# EAGLE design logoi_smd_gndpln v0.2 (EAGLE 9.0.0)
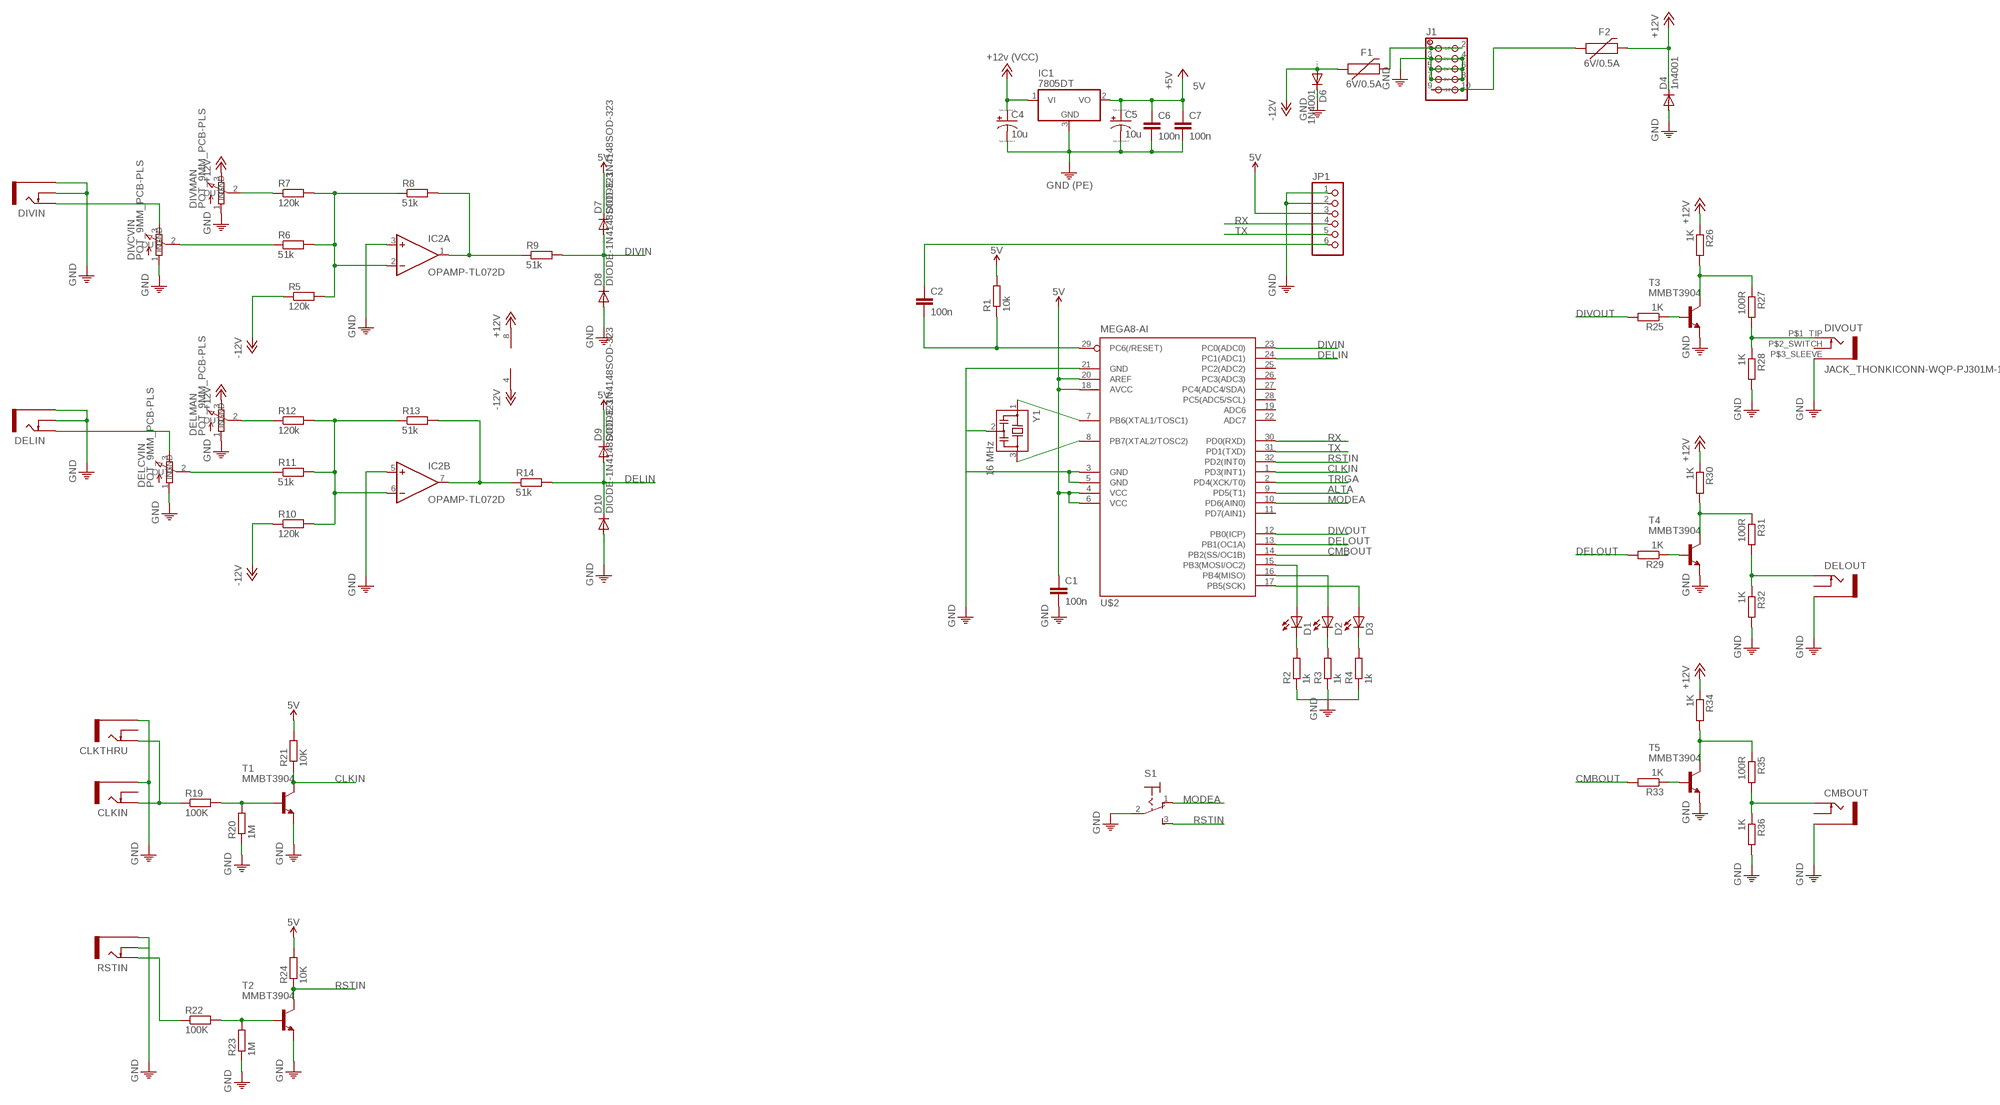
[diagram p0: schematic, sheet 1]

## Parts
C1  100n  CAPACITOR-EUC0603K  [C0603K]
C2  100n  CAPACITOR-EUC0603K  [C0603K]
C4  10u  CAPACITOR_POLARIZED-USB  [PANASONIC_B]
C5  10u  CAPACITOR_POLARIZED-USB  [PANASONIC_B]
C6  100n  CAPACITOR-EUC0603K  [C0603K]
C7  100n  CAPACITOR-EUC0603K  [C0603K]
CLKIN  JACK_THONKICONNNEW  [WQP-PJ301M-12_JACK]
CLKTHRU  JACK_THONKICONNNEW  [WQP-PJ301M-12_JACK]
CMBOUT  JACK_THONKICONNNEW  [WQP-PJ301M-12_JACK]
D1  LED3MM  [LED3MM]
D2  LED3MM  [LED3MM]
D3  LED3MM  [LED3MM]
D4  1n4001  DIODE-DO-214AC  [DO-214AC]
D6  1N4001  DIODE-DO-214AC  [DO-214AC]
D7  DIODE-1N4148SOD-323  [SOD323W_INFINEON]
D8  DIODE-1N4148SOD-323  [SOD323W_INFINEON]
D9  DIODE-1N4148SOD-323  [SOD323W_INFINEON]
D10  DIODE-1N4148SOD-323  [SOD323W_INFINEON]
DELCVIN  POT_9MM_PCB-PLS  [9MM_PLS]
DELIN  JACK_THONKICONNNEW  [WQP-PJ301M-12_JACK]
DELMAN  POT_9MM_PCB-PLS  [9MM_PLS]
DELOUT  JACK_THONKICONNNEW  [WQP-PJ301M-12_JACK]
DIVCVIN  POT_9MM_PCB-PLS  [9MM_PLS]
DIVIN  JACK_THONKICONNNEW  [WQP-PJ301M-12_JACK]
DIVMAN  POT_9MM_PCB-PLS  [9MM_PLS]
DIVOUT  JACK_THONKICONN-WQP-PJ301M-12  [WQP-PJ301M-12_JACK]
F1  6V/0.5A  FUSE-PPTC_HALF-AMP  [1206]
F2  6V/0.5A  FUSE-PPTC_HALF-AMP  [1206]
IC1  7805DT  [TO252]
IC2  OPAMP-TL072D  [SO08]
J1  HEADER-EUROPWR_2X05-OPEN  [2X05_EUROPWR_OPEN]
JP1  PINHD-1X6  [1X06]
R1  10k  RESISTOR-EU_R0603  [R0603]
R2  1k  RESISTOR-EU_R0603  [R0603]
R3  1k  RESISTOR-EU_R0603  [R0603]
R4  1k  RESISTOR-EU_R0603  [R0603]
R5  120k  RESISTOR-EU_R0603  [R0603]
R6  51k  RESISTOR-EU_R0603  [R0603]
R7  120k  RESISTOR-EU_R0603  [R0603]
R8  51k  RESISTOR-EU_R0603  [R0603]
R9  51k  RESISTOR-EU_R0603  [R0603]
R10  120k  RESISTOR-EU_R0603  [R0603]
R11  51k  RESISTOR-EU_R0603  [R0603]
R12  120k  RESISTOR-EU_R0603  [R0603]
R13  51k  RESISTOR-EU_R0603  [R0603]
R14  51k  RESISTOR-EU_R0603  [R0603]
R19  100K  RESISTOR-EU_R0603  [R0603]
R20  1M  RESISTOR-EU_R0603  [R0603]
R21  10K  RESISTOR-EU_R0603  [R0603]
R22  100K  RESISTOR-EU_R0603  [R0603]
R23  1M  RESISTOR-EU_R0603  [R0603]
R24  10K  RESISTOR-EU_R0603  [R0603]
R25  1K  RESISTOR-EU_R0603  [R0603]
R26  1K  RESISTOR-EU_R0603  [R0603]
R27  100R  RESISTOR-EU_R0603  [R0603]
R28  1K  RESISTOR-EU_R0603  [R0603]
R29  1K  RESISTOR-EU_R0603  [R0603]
R30  1K  RESISTOR-EU_R0603  [R0603]
R31  100R  RESISTOR-EU_R0603  [R0603]
R32  1K  RESISTOR-EU_R0603  [R0603]
R33  1K  RESISTOR-EU_R0603  [R0603]
R34  1K  RESISTOR-EU_R0603  [R0603]
R35  100R  RESISTOR-EU_R0603  [R0603]
R36  1K  RESISTOR-EU_R0603  [R0603]
RSTIN  JACK_THONKICONNNEW  [WQP-PJ301M-12_JACK]
S1  SWITCH-SPDT-320-916  [320-916]
T1  MMBT3904  TRANSISTOR-NPN-MMBT3904LT1SOT23-BEC  [SOT23-BEC]
T2  MMBT3904  TRANSISTOR-NPN-MMBT3904LT1SOT23-BEC  [SOT23-BEC]
T3  MMBT3904  TRANSISTOR-NPN-MMBT3904LT1SOT23-BEC  [SOT23-BEC]
T4  MMBT3904  TRANSISTOR-NPN-MMBT3904LT1SOT23-BEC  [SOT23-BEC]
T5  MMBT3904  TRANSISTOR-NPN-MMBT3904LT1SOT23-BEC  [SOT23-BEC]
U$2  MEGA8-AI  [TQFP32-08]
Y1  16 MHz  CSTCR6M00G53Z  [CSTCR6M]

## Nets
5V [GND]: C1.1 C5.+ C6.1 C7.1 D7.C D9.C IC1.2(VO) JP1.3 R1.2 R21.2 R24.2 U$2.4(VCC) U$2.6(VCC) U$2.18(AVCC) U$2.20(AREF) ; supply symbol labelled +5V
+12V [GND]: C4.+ D4.C DELMAN.3(IN) DIVMAN.3(IN) F2.2 IC1.1(VI) IC2.8(P:V+) R26.1 R30.1 R34.1 ; supply symbol labelled POWER+12V
-12V [GND]: D6.A F1.1 IC2.4(P:V-) R5.1 R10.1
ALTA: U$2.9(PD5(T1))
CLKIN: R21.1 T1.C U$2.1(PD3(INT1))
CMBOUT: R33.2 U$2.14(PB2(SS/OC1B))
DELIN: D9.A D10.C R14.2 U$2.24(PC1(ADC1))
DELOUT: R29.2 U$2.13(PB1(OC1A))
DIVIN: D7.A D8.C R9.2 U$2.23(PC0(ADC0))
DIVOUT: R25.2 U$2.12(PB0(ICP))
MODEA: S1.1(O) U$2.10(PD6(AIN0))
N$1: U$2.7(PB6(XTAL1/TOSC1)) Y1.1
N$2: U$2.8(PB7(XTAL2/TOSC2)) Y1.3
N$3 [GND]: F1.2 J1.1 J1.2
N$4: C2.2 R1.1 U$2.29(PC6(/RESET))
N$5: C2.1 JP1.6
N$7 [GND]: F2.1 J1.9 J1.10
N$9: IC2.2(A:-IN) R5.2 R6.2 R7.2 R8.1
N$10: IC2.1(A:OUT) R8.2 R9.1
N$12: R25.1 T3.B
N$13: IC2.6(B:-IN) R10.2 R11.2 R12.2 R13.1
N$14: R26.2 R27.1 T3.C
N$15: IC2.7(B:OUT) R13.2 R14.1
N$17: DIVOUT.P$1_TIP R27.2 R28.1
N$18: DIVCVIN.3(IN) DIVIN.P$1_TIP(TIP)
N$19: DIVCVIN.2(OUT) R6.1
N$20: DIVMAN.2(OUT) R7.1
N$21: D1.K(C) R2.2
N$22: D2.K(C) R3.2
N$23: D3.K(C) R4.2
N$24: D1.A U$2.15(PB3(MOSI/OC2))
N$25: D2.A U$2.16(PB4(MISO))
N$26: D3.A U$2.17(PB5(SCK))
N$27: DELCVIN.2(OUT) R11.1
N$28: DELCVIN.3(IN) DELIN.P$1_TIP(TIP)
N$29: DELMAN.2(OUT) R12.1
N$30: CLKIN.P$1_TIP(TIP) CLKTHRU.P$1_TIP(TIP) R19.1
N$31: R19.2 R20.2 T1.B
N$33: R22.1 RSTIN.P$1_TIP(TIP)
N$34: R22.2 R23.2 T2.B
N$35: R29.1 T4.B
N$36: R30.2 R31.1 T4.C
N$37: DELOUT.P$1_TIP(TIP) R31.2 R32.1
N$39: R33.1 T5.B
N$40: R34.2 R35.1 T5.C
N$41: CMBOUT.P$1_TIP(TIP) R35.2 R36.1
PE [GND]: C1.2 C4.- C5.- C6.2 C7.2 CLKIN.P$3_SLEEVE(SLEEVE) CLKTHRU.P$3_SLEEVE(SLEEVE) CMBOUT.P$3_SLEEVE(SLEEVE) D4.A D6.C D8.A D10.A DELCVIN.1(GND) DELIN.P$2_SWITCH(SWITCH) DELIN.P$3_SLEEVE(SLEEVE) DELMAN.1(GND) DELOUT.P$3_SLEEVE(SLEEVE) DIVCVIN.1(GND) DIVIN.P$2_SWITCH(SWITCH) DIVIN.P$3_SLEEVE(SLEEVE) DIVMAN.1(GND) DIVOUT.P$3_SLEEVE IC1.3(GND) IC2.3(A:+IN) IC2.5(B:+IN) J1.3 J1.4 J1.5 J1.6 J1.7 J1.8 JP1.1 JP1.2 R2.1 R3.1 R4.1 R20.1 R23.1 R28.2 R32.2 R36.2 RSTIN.P$2_SWITCH(SWITCH) RSTIN.P$3_SLEEVE(SLEEVE) S1.2(P) T1.E T2.E T3.E T4.E T5.E U$2.3(GND) U$2.5(GND) U$2.21(GND) Y1.2 ; supply symbol labelled GND, POWER-GND
RSTIN: R24.1 S1.3(S) T2.C U$2.32(PD2(INT0))
RX: JP1.4 U$2.30(PD0(RXD))
TRIGA: U$2.2(PD4(XCK/T0))
TX: JP1.5 U$2.31(PD1(TXD))
Unconnected: CLKIN.P$2_SWITCH(SWITCH) CLKTHRU.P$2_SWITCH(SWITCH) CMBOUT.P$2_SWITCH(SWITCH) DELOUT.P$2_SWITCH(SWITCH) DIVOUT.P$2_SWITCH U$2.11(PD7(AIN1)) U$2.19(ADC6) U$2.22(ADC7) U$2.25(PC2(ADC2)) U$2.26(PC3(ADC3)) U$2.27(PC4(ADC4/SDA)) U$2.28(PC5(ADC5/SCL))

## Library data of the parts
C1 C2 C6 C7 = 0000-master:CAPACITOR-EU: CAPACITOR, European symbol
C4 C5 = 0000-master:CAPACITOR_POLARIZED-US: POLARIZED CAPACITOR, American symbol
CLKIN CLKTHRU CMBOUT DELIN DELOUT DIVIN RSTIN = 0000-master:JACK_THONKICONN: 3.5mm socket for Eurorack modular synths
D1-D3 = 0000-master:LED: LED OSRAM: - CHIPLED LG R971, LG N971, LY N971, LG Q971, LY Q971, LO R971, LY R971 LH N974, LH R974 LS Q976, LO Q976, LY Q976 LO Q996 - Hyper CHIPLED LW Q18S LB Q993, LB Q99A, LB R99A - SideLED LS A670, LO A670, LY A670, LG A670, LP A670 LB A673, LV A673, LT A673, LW A673 LH A674 LY A675 LS A676, LA A676, LO A676, LY A676, LW A676 LS A679, LY A679, LG A679 - Hyper Micro SIDELED® LS Y876, LA Y876, LO Y876, LY Y876 LT Y87S - SmartLED LW L88C, LW L88S LB L89C, LB L89S, LG L890 LS L89K, LO L89K, LY L89K LS L896, LA L896, LO L896, LY L896 - TOPLED LS T670, LO T670, LY T670, LG T670, LP T670 LSG T670, LSP T670, LSY T670, LOP T670, LYG T670 LG T671, LOG T671, LSG T671 LB T673, LV T673, LT T673, LW T673 LH T674 LS T676, LA T676, LO T676, LY T676, LB T676, LH T676, LSB T676, LW T676 LB T67C, LV T67C, LT T67C, LS T67K, LO T67K, LY T67K, LW E67C LS E67B, LA E67B, LO E67B, LY E67B, LB E67C, LV E67C, LT E67C LW T67C LS T679, LY T679, LG T679 LS T770, LO T770, LY T770, LG T770, LP T770 LB T773, LV T773, LT T773, LW T773 LH T774 LS E675, LA E675, LY E675, LS T675 LS T776, LA T776, LO T776, LY T776, LB T776 LHGB T686 LT T68C, LB T68C - Hyper Mini TOPLED® LB M676 - Mini TOPLED Santana® LG M470 LS M47K, LO M47K, LY M47K Source: http://www.osram.convergy.de LUXEON: - LUMILED® LXK2-PW12-R00, LXK2-PW12-S00, LXK2-PW14-U00, LXK2-PW14-V00 LXK2-PM12-R00, LXK2-PM12-S00, LXK2-PM14-U00 LXK2-PE12-Q00, LXK2-PE12-R00, LXK2-PE12-S00, LXK2-PE14-T00, LXK2-PE14-U00 LXK2-PB12-K00, LXK2-PB12-L00, LXK2-PB12-M00, LXK2-PB14-N00, LXK2-PB14-P00, LXK2-PB14-Q00 LXK2-PR12-L00, LXK2-PR12-M00, LXK2-PR14-Q00, LXK2-PR14-R00 LXK2-PD12-Q00, LXK2-PD12-R00, LXK2-PD12-S00 LXK2-PH12-R00, LXK2-PH12-S00 LXK2-PL12-P00, LXK2-PL12-Q00, LXK2-PL12-R00 Source: www.luxeon.com KINGBRIGHT: KA-3528ASYC Source: www.kingbright.com
D4 D6 = diode:DIODE-: DIODE
D7-D10 = 0000-master:DIODE-1N4148: DIODE high speed (Philips)
DELCVIN DELMAN DIVCVIN DIVMAN = 0000-master:POT_9MM_PCB: 9 mm Square Rotary Potentiometers Source: Panasonic
DIVOUT = 0000-master:JACK_THONKICONN-WQP-PJ301M-12
F1 F2 = 0000-master:FUSE-PPTC: Resettable Fuse PPTC Resettable Fuse. Really a sort of resistor with a polymeric positive temperature coefficient whose resistance increases dramatically with an increase in temperature. When heated by the power passing through the resistance rises causing the current to be limited, protecting the circuit. This is achieved by the transition of the polymer from a crystalline to an amorphous state where the conductive carbon separates breaking the conductive pathways found in the cool crystalline structure. When a PPTC cools back down it resumes conducting letting the circuit turn back on. SparkFun Products: SparkFun RedBoard - Programmed with Arduino <https://www.sparkfun.com/products/12757> Pro Micro - 5V/16MHz <https://www.sparkfun.com/products/12640> Arduino Pro 328 - 5V/16MHz <https://www.sparkfun.com/products/10915> MP3 Trigger <https://www.sparkfun.com/products/13720>; PROD_ID: RES-08585
IC1 = linear:78*: Positive VOLTAGE REGULATOR Source: http://cache.national.com/ds/LM/LM78L05.pdf http://www.fairchildsemi.com/ds/LM/LM7805.pdf
IC2 = 0000-master:OPAMP-TL072: OP AMP
J1 = 0000-master:HEADER-EUROPWR_2X05: 2x05 pin header
JP1 = pinhead:PINHD-1X6: PIN HEADER
R1-R14 R19-R36 = 0000-master:RESISTOR-EU_: RESISTOR, European symbol
S1 = 0000-master:SWITCH-SPDT-320-916: TOGGLE SWITCH distributor RS Components
T1-T5 = 0000-master:TRANSISTOR-NPN-: NPN Transistror BF959 corrected 2008.03.06
U$2 = atmel:MEGA8: MICROCONTROLLER 8 Kbytes FLASH, 1 kbytes SRAM, 512 bytes EEPROM, USART, 6-channel 10 bit ADC, 2-channel 8 bit ADC Pin compatible with Atmega48, ATMega88, ATMega168 Source: avr.lbr; MPN: ATMEGA8-16AU; OC_FARNELL: 9171371; OC_NEWARK: 73M8863
Y1 = murata-filter:CSTCR: Resonator Source: murata.co.jp; MPN: CSTCR6M00G53-R0; OC_FARNELL: 1170434; OC_NEWARK: 25M8759

## Net classes
0 default: width 0.203 mm
1 GND: width 0.305 mm

## Board
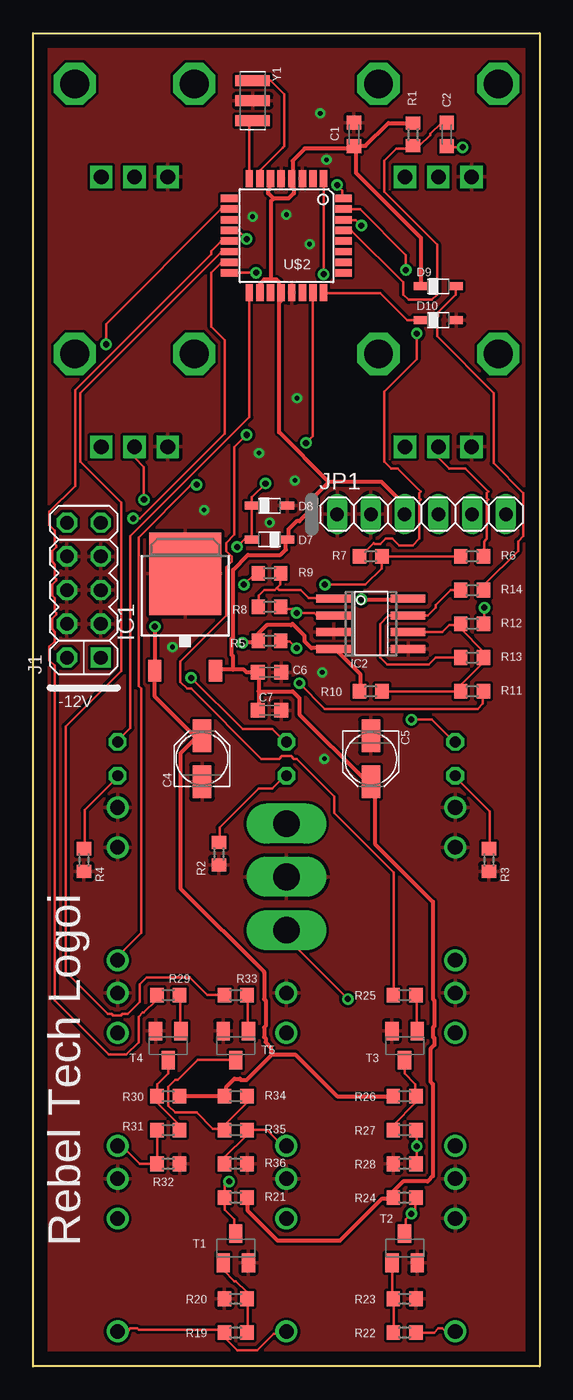
[diagram p1: board, top side]
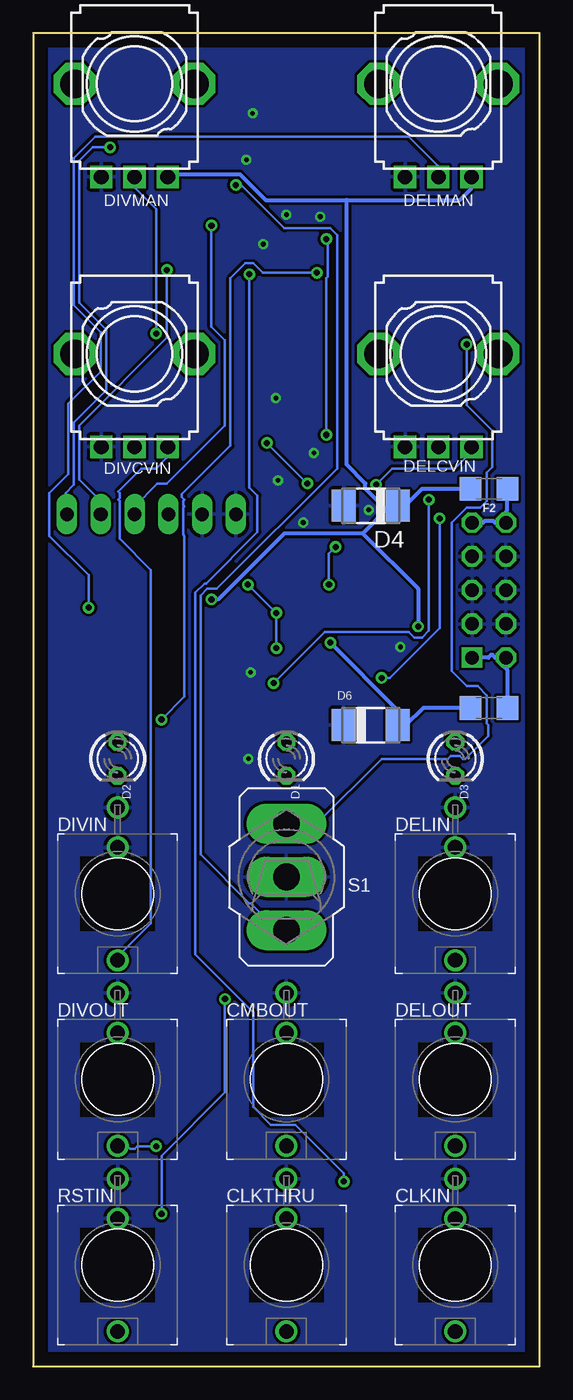
[diagram p2: board, bottom side, seen from below]

Size 38.1 x 100.33 mm. Coordinates in mm from the lower left corner, seen from the top.
Outline: 0,0 0,100.33 38.1,100.33 38.1,0 0,0
Copper layers (1*16): Top 0.035mm / dielectric 1.5mm / Bottom 0.035mm
Design rules "default *": minimum track width 8mil, minimum drill 18mil, track to track 8mil, track to pad 8mil, pad to pad 8mil, via to via 8mil, smd to smd 8mil, copper to edge 40mil, drill to drill 8mil, minimum pad ring 10mil, minimum via ring 8mil, stop-mask expansion 4mil, vias tented up to drill 18mil, thermal gap 10mil

### Footprints (pad centres in the part's own frame; a part is rotated, then mirrored left to right if it is on the bottom)
C0603K = smd 1.05 x 1.08: 1 -0.875,0; 2 0.875,0
PANASONIC_B = smd 2.454 x 1.4: + 1.727,0; - -1.727,0
WQP-PJ301M-12_JACK = drill 1.1: P$1_TIP 0,5; P$2_SWITCH 0,-3.5; P$3_SLEEVE 0,-6.5
LED3MM = drill 0.813 octagon: A -1.27,0; K 1.27,0
DO-214AC = smd 1.8 x 2.4: A 2.025,0; C -2.025,0
SOD323W_INFINEON = smd 1 x 0.6: A 1.35,0; C -1.35,0
9MM_PLS = drill 1.1 pad 1.676 square: 1 -2.5,-7; 2 0,-7; 3 2.5,-7 | drill 2.159 pad 3.175 octagon: M1 4.5,0; M2 -4.5,0
1206 = smd 1.6 x 1.8: 1 -1.4,0; 2 1.4,0
TO252 = smd 1 x 1.6: 1 -2.28,-4.8; 2 2.28,-4.8 | smd 5.4 x 6.2: 3 0,2.5
SO08 = smd 0.6 x 2.6: 1 -1.905,-2.8; 2 -0.635,-2.8; 3 0.635,-2.8; 4 1.905,-2.8; 5 1.905,2.8; 6 0.635,2.8; 7 -0.635,2.8; 8 -1.905,2.8
2X05_EUROPWR_OPEN = drill 1.016 square: 1 -5.08,-1.27 | drill 1.016 octagon: 2 -5.08,1.27; 3 -2.54,-1.27; 4 -2.54,1.27; 5 0,-1.27; 6 0,1.27; 7 2.54,-1.27; 8 2.54,1.27; 9 5.08,-1.27; 10 5.08,1.27
1X06 = drill 1.016 long: 1 -6.35,0; 2 -3.81,0; 3 -1.27,0; 4 1.27,0; 5 3.81,0; 6 6.35,0
R0603 = smd 1 x 1.1: 1 -0.85,0; 2 0.85,0
320-916 = drill 2.007 long: 1 0,4.013; 2 0,0; 3 0,-4.013
SOT23-BEC = smd 1 x 1.4: B -0.95,-1.1; C 0,1.1; E 0.95,-1.1
TQFP32-08 = smd 1.27 x 0.559: 1 -4.293,2.8; 2 -4.293,2; 3 -4.293,1.2; 4 -4.293,0.4; 5 -4.293,-0.4; 6 -4.293,-1.2; 7 -4.293,-2; 8 -4.293,-2.8; 17 4.293,-2.8; 18 4.293,-2; 19 4.293,-1.2; 20 4.293,-0.4; 21 4.293,0.4; 22 4.293,1.2; 23 4.293,2; 24 4.293,2.8 | smd 0.559 x 1.27: 9 -2.8,-4.293; 10 -2,-4.293; 11 -1.2,-4.293; 12 -0.4,-4.293; 13 0.4,-4.293; 14 1.2,-4.293; 15 2,-4.293; 16 2.8,-4.293; 25 2.8,4.293; 26 2,4.293; 27 1.2,4.293; 28 0.4,4.293; 29 -0.4,4.293; 30 -1.2,4.293; 31 -2,4.293; 32 -2.8,4.293
CSTCR6M = smd 0.8 x 2.6: 1 -1.5,0; 2 0,0; 3 1.5,0

### Placement (x,y rotation side)
C1  24.13,92.71 90 top
C2  31.11,92.71 90 top
C4  12.7,45.72 90 top
C5  25.4,45.72 270 top
C6  17.78,52.23 0 top
C7  17.78,49.37 0 top
CLKIN  6.35,7.62 180 bottom
CLKTHRU  19.05,7.62 180 bottom
CMBOUT  19.05,21.59 180 bottom
D1  19.05,45.72 270 bottom
D2  31.75,45.72 270 bottom
D3  6.35,45.72 270 bottom
D4  12.7,64.77 180 bottom
D6  12.7,48.26 0 bottom
D7  17.78,62.23 180 top
D8  17.78,64.77 0 top
D9  30.48,81.28 0 top
D10  30.48,78.74 0 top
DELCVIN  7.62,76.2 0 bottom
DELIN  6.35,35.56 180 bottom
DELMAN  7.62,96.52 0 bottom
DELOUT  6.35,21.59 180 bottom
DIVCVIN  30.48,76.2 0 bottom
DIVIN  31.75,35.56 180 bottom
DIVMAN  30.48,96.52 0 bottom
DIVOUT  31.75,21.59 180 bottom
F1  3.81,49.53 0 bottom
F2  3.81,66.04 180 bottom
IC1  11.43,57.15 0 top
IC2  25.4,55.88 270 top
J1  3.81,58.42 90 top
JP1  29.21,64.14 0 top
R1  28.57,92.71 90 top
R2  13.97,38.58 90 top
R3  34.29,38.1 90 top
R4  3.81,38.1 90 top
R5  17.78,54.61 0 top
R6  33.02,60.96 180 top
R7  25.4,60.96 0 top
R8  17.78,57.15 180 top
R9  17.78,59.69 180 top
R10  25.4,50.8 0 top
R11  33.02,50.8 180 top
R12  33.02,55.88 180 top
R13  33.02,53.34 180 top
R14  33.02,58.42 0 top
R19  15.24,2.54 0 top
R20  15.24,5.08 0 top
R21  15.24,12.7 0 top
R22  27.94,2.54 180 top
R23  27.94,5.08 180 top
R24  27.94,12.7 180 top
R25  27.94,27.94 180 top
R26  27.94,20.32 0 top
R27  27.94,17.78 0 top
R28  27.94,15.24 180 top
R29  10.16,27.94 180 top
R30  10.16,20.32 180 top
R31  10.16,17.78 180 top
R32  10.16,15.24 0 top
R33  15.24,27.94 180 top
R34  15.24,20.32 0 top
R35  15.24,17.78 0 top
R36  15.24,15.24 0 top
RSTIN  31.75,7.62 180 bottom
S1  19.05,36.83 0 bottom
T1  15.24,8.89 0 top
T2  27.94,8.89 0 top
T3  27.94,24.13 180 top
T4  10.16,24.13 180 top
T5  15.24,24.13 180 top
U$2  19.05,85.09 270 top
Y1  16.51,95.25 270 top

### Tracks (layer width: path | path; a pad name or v marks a point on that pad's centre or on a via)
5V
  Top 0.305: 17.88,81.79 18.29,81.79 18.49,81.58 18.49,80.97 18.59,80.87 U$2.20 18.59,80.67 18.59,80.16 18.49,80.06 18.49,70.31 22.25,66.55 | 17.88,81.79 17.37,81.79 17.07,81.48 17.07,80.87 U$2.18 | 18.09,87.88 17.68,88.29 17.68,88.49 17.78,88.59 17.78,89.31 U$2.6 | 18.09,87.88 19.2,87.88 19.61,88.29 19.61,88.59 19.41,88.8 19.41,89.31 U$2.4 19.51,89.51 19.51,90.73 20.42,91.64 24.08,91.64 C1.1 | 17.88,81.79 17.88,87.68 18.09,87.88 | D9.C 29.16,81.28 29.16,84.94 24.28,89.81 24.28,91.64 24.18,91.75 C1.1 | R1.2 28.55,93.57 26.72,93.57 24.99,91.85 24.28,91.85 C1.1 | 22.25,66.55 21.23,65.53 21.23,64.82 20.02,63.6 19.81,63.6 19.2,62.99 19.2,62.28 D7.C 19,62.18 19,61.47 18.59,61.06 16.15,61.06 15.04,59.94 15.04,54.86 14.94,54.76 14.94,53.54 15.04,53.44 15.04,52.43 | 22.25,66.55 26.21,66.55 27.94,64.82 JP1.3 | R21.2 16.15,12.7 16.15,11.68 18.39,9.45 23.06,9.45 26.21,12.6 26.92,12.6 27.03,12.7 R24.2 27.13,12.8 27.13,13.21 27.84,13.92 29.67,13.92 30.07,14.33 30.07,21.23 29.87,21.44 29.87,23.88 30.18,24.18 30.18,24.69 30.07,24.79 30.07,25.5 30.18,25.6 30.18,27.53 30.07,27.64 30.07,34.95 25.7,39.32 25.7,43.69 C5.+ | 16.97,50.8 16.97,52.22 C6.1 16.87,52.22 16.05,52.22 15.85,52.43 15.04,52.43 | 16.97,50.8 16.97,49.38 C7.1 | 15.04,52.43 13.72,52.43 IC1.2 | 16.97,50.8 19.51,50.8 20.02,50.29 20.02,49.07 24.89,44.2 25.4,44.2 C5.+ | C5.+
+12V  (via drill 0.46)
  Top 0.305: R30.1 R34.1 14.53,20.32 14.53,21.03 15.14,21.64 15.54,21.64 15.65,21.54 16.05,21.54 17.98,23.47 | R26.1 22.86,20.32 19.71,23.47 17.98,23.47 | v24.69,57.71 28.14,57.71 IC2.8 | v9.14,55.68 9.14,52.43 IC1.1 9.14,52.32 9.14,50.39 12.19,47.35 12.7,47.35 C4.+ 12.29,47.24 12.19,47.14 12.09,47.14 11.07,46.13 11.07,35.97 17.37,29.67 17.37,27.64 17.48,27.53 17.48,25.6 17.37,25.5 17.37,24.79 17.48,24.69 17.48,24.38 17.88,23.98 17.88,23.57 17.98,23.47
  Bottom 0.305: 14.53,87.78 20.62,87.78 22.55,89.71 27.84,89.71 27.94,89.61 DIVMAN.3 | 14.53,87.78 5.99,87.78 5.18,88.59 5.18,89.51 DELMAN.3 | F2.2 8.84,66.04 10.06,64.82 10.67,64.82 D4.C 10.77,64.72 11.28,64.72 11.53,64.47 | v24.69,57.71 24.18,57.71 19.2,62.69 13.31,62.69 | 11.53,64.47 13.31,62.69 | v9.14,55.68 9.14,58.52 13.31,62.69 | 14.53,87.78 14.53,67.87 13.11,66.45 13.11,66.04 11.53,64.47
-12V  (via drill 0.46)
  Top 0.305: R10.1 24.59,50.8 24.59,52.12 22.66,54.05 IC2.4 22.55,54.05 20.93,54.05 20.42,54.56 20.42,54.97 19.51,55.88 19.41,55.78 17.58,55.78 16.97,55.17 16.97,54.66 R5.1 16.87,54.56 16.76,54.46 v15.75,54.46
  Bottom 0.305: F1.1 5.28,49.58 8.74,49.58 10.06,48.26 D6.A 10.77,48.36 10.77,49.48 v15.75,54.46
CLKIN  (via drill 0.46)
  Top 0.203: 14.43,12.7 14.43,11.79 15.14,11.07 15.14,10.16 15.24,10.06 T1.C | v21.84,82.19 21.84,89.31 U$2.1 | v14.73,13.92 14.43,13.61 14.43,12.7 | 14.43,12.7 R21.1
  Bottom 0.203: v21.84,82.19 21.84,66.14 21.23,65.53 21.23,62.79 25.09,58.93 25.2,58.93 25.91,58.22 25.91,30.99 21.54,26.62 21.54,19.51 20.22,18.19 18.39,18.19 14.73,14.53 v14.73,13.92
CMBOUT
  Top 0.203: R33.2 13.11,27.94 11.79,29.26 8.53,29.26 8.03,28.75 8.03,27.43 7.11,26.52 6.71,26.52 6.6,26.42 5.99,26.42 5.89,26.52 5.59,26.52 2.44,29.67 2.44,48.16 6.6,52.32 6.6,65.02 3.56,68.07 3.56,73.25 14.12,83.82 14.73,83.82 U$2.14
DELIN
  Top 0.203: 30.23,78.79 30.48,79.05 30.48,79.35 31.8,80.67 31.8,81.28 D9.A | 30.23,78.79 30.18,78.74 D10.C 28.14,78.74 26.11,80.77 21.95,80.77 U$2.24 | 30.23,78.79 30.38,78.64 30.38,77.52 34.65,73.25 34.65,67.97 36.88,65.73 36.88,62.48 36.47,62.08 36.47,61.37 33.93,58.83 33.93,58.42 R14.2
DELOUT
  Top 0.203: R29.2 9.25,27.94 9.25,27.53 8.33,26.62 8.23,26.62 7.92,26.31 7.92,24.38 7.01,23.47 5.69,23.47 1.63,27.53 1.63,52.73 1.22,53.14 1.22,54.15 1.63,54.56 1.63,55.27 1.42,55.47 1.42,56.29 1.73,56.59 1.73,56.69 1.63,56.79 1.63,57.81 1.42,58.01 1.42,58.83 1.73,59.13 1.73,59.23 1.63,59.33 1.63,60.35 1.42,60.55 1.42,61.37 1.73,61.67 1.73,61.77 1.63,61.87 1.63,62.89 1.22,63.3 1.22,64.31 3.15,66.24 3.15,73.46 13.41,83.72 13.41,83.92 14.12,84.63 14.73,84.63 U$2.13
DIVIN  (via drill 0.46)
  Top 0.203: v15.85,58.83 16.66,59.64 16.87,59.64 R9.2 | v15.34,61.67 15.95,62.28 16.36,62.28 D7.A 16.46,62.28 16.46,64.72 D8.C 16.46,64.82 16.46,65.43 v17.48,66.45 | v20.52,69.49 21.03,70 21.03,80.77 U$2.23
  Bottom 0.203: v15.85,58.83 15.85,61.16 v15.34,61.67 | v17.48,66.45 v20.52,69.49
DIVOUT  (via drill 0.46)
  Top 0.203: v16.05,70.1 15.14,69.19 15.14,62.59 14.53,61.98 14.53,61.37 14.94,60.96 14.94,60.55 14.53,60.15 14.53,56.49 11.07,53.03 11.07,51.51 11.58,51 11.89,51 17.17,45.72 18.49,45.72 18.69,45.92 19.41,45.92 19.61,45.72 19.81,45.72 22.66,42.88 22.66,41.66 27.13,37.19 27.13,27.94 R25.2 | v16.05,84.84 15.34,85.55 14.83,85.55 U$2.12
  Bottom 0.203: v16.05,70.1 16.05,81.89 15.95,81.99 15.95,84.73 v16.05,84.84
MODEA  (via drill 0.46)
  Top 0.203: v5.49,76.91 5.49,78.44 14.12,87.07 14.73,87.07 U$2.10
  Bottom 0.203: v5.49,76.91 5.49,72.34 3.56,70.41 3.56,67.67 3.96,67.26 3.96,65.13 4.47,64.62 5.49,64.62 6.6,63.5 6.6,52.32 5.49,51.21 4.67,51.21 3.96,50.49 3.96,48.36 3.86,48.26 3.86,47.45 5.59,45.72 5.79,45.72 5.99,45.92 6.71,45.92 6.91,45.72 11.89,45.72 16.76,40.84 S1.1
N$1
  Top 0.203: 18.9,91.85 18.89,91.84 | U$2.7 17.07,89.41 17.07,90.02 18.77,91.72 18.89,91.84 | Y1.1 17.87,96.75 18.89,95.73 18.89,91.84
N$2
  Top 0.203: 16.26,89.41 U$2.8 16.25,93.49 Y1.3
N$3
  Bottom 0.305: F1.2 2.44,49.58 2.44,52.43 2.64,52.63 2.64,53.24 J1.2 3.35,53.34 3.56,53.54 3.66,53.54 3.86,53.34 J1.1
N$4
  Top 0.203: C2.2 31.09,93.57 30.68,93.57 29.87,92.76 29.87,92.66 29.06,91.85 28.65,91.85 R1.1 28.55,91.85 28.35,91.64 27.33,91.64 26.42,90.73 26.42,88.39 30.38,84.43 30.38,80.67 29.97,80.26 28.25,80.26 27.84,80.67 27.84,81.58 23.98,85.45 23.37,85.45 U$2.29
N$5  (via drill 0.46)
  Top 0.203: v32.31,91.75 31.19,91.75 C2.1
  Bottom 0.203: v32.31,91.75 33.63,91.75 34.65,90.73 34.65,80.06 32.61,78.03 32.61,73.46 35.05,71.02 35.05,66.34 35.66,65.73 35.66,64.31 35.56,64.21 JP1.6
N$7
  Bottom 0.305: F2.1 2.44,66.04 2.44,64.41 2.54,64.31 J1.10 3.35,63.5 3.45,63.6 4.17,63.6 4.27,63.5 J1.9
N$9  (via drill 0.46)
  Top 0.203: R6.2 R7.2 26.21,60.96 26.21,60.05 24.99,58.83 v21.95,58.83 | v19.81,54.05 19.3,54.56 18.69,54.56 R5.2 | R8.1 18.69,57.1 18.8,57 19.51,57 v19.81,56.69 21.13,56.69 21.34,56.49 22.55,56.49 IC2.2
  Bottom 0.203: v19.81,54.05 v19.81,56.69 v21.95,58.83
N$10
  Top 0.203: 18.34,58.57 18.59,58.83 18.59,59.64 R9.1 | 18.34,58.57 18.19,58.42 17.37,58.42 16.97,58.01 16.97,57.2 R8.2 | 18.34,58.57 18.49,58.42 20.12,58.42 20.73,57.81 22.55,57.81 IC2.1
N$12
  Top 0.203: R25.1 28.85,27.94 28.85,25.3 T3.B
N$13
  Top 0.203: 32.21,55.78 32.21,55.47 33.83,53.85 33.83,53.34 | 32.21,55.78 32.21,55.88 R12.2 32.21,55.78 | R10.2 R11.2 32.21,50.8 32.21,51.31 33.83,52.93 33.83,53.34 | 33.83,53.34 R13.1 | 32.21,55.78 31.29,55.78 30.79,55.27 28.25,55.27 IC2.6
N$14
  Top 0.203: 28.75,20.32 28.75,19.81 27.13,18.19 27.13,17.78 R27.1 | T3.C 27.94,22.05 28.75,21.23 28.75,20.32 | 28.75,20.32 R26.2
N$15
  Top 0.203: R13.2 30.28,53.34 29.77,52.83 26.62,52.83 26.11,53.34 26.11,55.88 26.72,56.49 28.14,56.49 IC2.7 28.25,56.49 29.67,56.49 30.28,57.1 30.28,57.3 31.39,58.42 R14.1
N$17  (via drill 0.46)
  Top 0.203: R28.1 28.85,15.24 v28.85,16.56 28.85,17.78 R27.2
  Bottom 0.203: v28.85,16.56 30.28,16.56 30.48,16.36 30.79,16.36 30.99,16.56 31.7,16.56 DIVOUT.P$1_TIP
N$18
  Bottom 0.203: DIVIN.P$1_TIP 31.7,30.58 31.7,30.89 29.26,33.33 29.26,59.94 31.6,62.28 31.6,65.13 31.7,65.23 31.6,65.33 31.6,65.73 31.7,65.84 29.97,67.56 28.85,67.56 28.04,68.38 28.04,69.19 DIVCVIN.3
N$19
  Top 0.203: DIVCVIN.2 30.48,68.38 31.29,67.56 32.51,67.56 34.24,65.84 34.14,65.73 34.14,65.33 34.24,65.23 34.14,65.13 34.14,62.28 33.93,62.08 33.93,60.96 R6.1
N$20  (via drill 0.46)
  Top 0.203: v28.85,77.72 28.85,75.79 26.42,73.36 26.42,68.07 26.92,67.56 27.43,67.56 29.16,65.84 29.06,65.73 29.06,65.33 29.16,65.23 29.06,65.13 29.06,62.28 28.55,61.77 27.53,61.77 27.03,62.28 26.52,62.28 26.11,61.87 25.7,61.87 25.6,61.98 24.59,60.96 R7.1
  Bottom 0.203: v28.85,77.72 28.85,87.07 30.48,88.7 DIVMAN.2
N$21
  Top 0.203: R2.2 14.02,39.52 14.02,40.54 16.97,43.48 17.98,43.48 19,44.5 D1.K
N$22
  Top 0.203: R3.2 34.34,39.01 34.34,41.76 31.7,44.4 D2.K
N$23
  Top 0.203: R4.2 3.86,39.01 3.86,41.86 6.4,44.4 D3.K
N$24  (via drill 0.46)
  Top 0.203: v7.52,63.8 8.03,63.8 14.43,70.21 14.43,77.22 13.41,78.23 13.41,82.3 14.12,83.01 14.73,83.01 U$2.15 | v11.89,51.82 15.75,47.95 17.98,47.95 19,46.94 D1.A
  Bottom 0.203: v7.52,63.8 7.52,55.58 11.28,51.82 v11.89,51.82
N$25  (via drill 0.46)
  Top 0.203: v16.76,82.3 14.83,82.3 U$2.16 | v28.45,48.67 29.97,48.67 31.7,46.94 D2.A
  Bottom 0.203: v16.76,82.3 20.83,82.3 21.54,83.01 22.15,83.01 23.27,81.89 23.27,69.29 26.92,65.63 26.92,65.43 26.72,65.23 26.82,65.13 26.82,64.82 26.72,64.72 26.82,64.62 26.82,62.59 26.72,62.48 26.72,50.39 v28.45,48.67
N$26
  Top 0.203: U$2.17 16.26,80.77 16.26,71.42 7.32,62.48 7.32,48.06 6.3,47.04 D3.A
N$27  (via drill 0.46)
  Top 0.203: v20.02,51.41 21.95,49.48 33.43,49.48 33.83,49.89 33.83,50.8 R11.1 | v8.33,65.23 8.33,67.67 7.62,68.38 DELCVIN.2
  Bottom 0.203: v20.02,51.41 16.15,55.27 9.86,55.27 9.45,54.86 8.84,54.86 8.33,55.37 v8.33,65.23
N$28  (via drill 0.46)
  Top 0.203: v12.29,66.34 11.89,66.34 7.92,62.38 7.92,51.21 8.13,51 8.13,32.61 6.4,30.89 6.4,30.58 DELIN.P$1_TIP
  Bottom 0.203: v12.29,66.34 11.07,67.56 6.4,67.56 5.18,68.78 5.18,69.19 DELCVIN.3
N$29  (via drill 0.46)
  Top 0.203: v33.93,57.1 33.93,55.88 R12.1
  Bottom 0.203: v33.93,57.1 33.93,59.54 36.88,62.48 36.88,65.73 35.46,67.16 35.46,72.44 33.02,74.88 33.02,77.83 35.05,79.86 35.05,90.93 33.43,92.56 9.86,92.56 7.62,90.32 DELMAN.2
N$30
  Top 0.203: CLKTHRU.P$1_TIP 19,2.54 18.9,2.44 18.09,2.44 16.87,1.22 15.34,1.22 14.43,2.13 14.43,2.54 R19.1 14.33,2.54 14.12,2.74 7.92,2.74 7.82,2.85 7.32,2.85 7.11,2.64 6.4,2.64 CLKIN.P$1_TIP
N$31
  Top 0.203: R19.2 16.15,2.54 16.15,5.08 R20.2 16.05,5.08 16.05,5.59 15.24,6.4 15.14,6.4 14.33,7.21 14.33,7.72 T1.B
N$33
  Top 0.203: R22.1 30.18,2.54 30.48,2.85 30.79,2.85 30.99,2.64 31.7,2.64 RSTIN.P$1_TIP
N$34
  Top 0.203: R22.2 27.13,2.54 27.13,5.08 R23.2 27.03,5.08 27.03,7.72 T2.B
N$35
  Top 0.203: R29.1 11.07,27.94 11.07,25.3 T4.B
N$36
  Top 0.203: 9.35,20.32 9.35,19.81 10.97,18.19 10.97,17.78 R31.1 | T4.C 10.16,22.05 9.35,21.23 9.35,20.32 | 9.35,20.32 R30.2
N$37
  Top 0.203: R31.2 9.35,17.78 9.35,15.24 R32.1 8.03,15.24 6.71,16.56 6.4,16.56 DELOUT.P$1_TIP
N$39
  Top 0.203: R33.1 16.15,27.94 16.15,25.3 T5.B
N$40
  Top 0.203: 14.43,17.88 14.43,18.19 16.05,19.81 16.05,20.32 R34.2 | 14.43,17.88 14.43,17.78 R35.1 14.43,17.88 | 14.43,17.88 13.51,17.88 12.29,19.1 10.67,19.1 10.16,19.61 10.16,21.03 10.67,21.54 10.87,21.54 12.39,23.06 15.24,23.06 T5.C
N$41
  Top 0.203: R36.1 14.43,15.24 14.43,15.75 16.05,17.37 16.05,17.78 R35.2 17.58,17.78 18.69,16.66 19,16.66 CMBOUT.P$1_TIP
PE  (via drill 0.35)
  other vias: 22.07,90.81 16.51,86.52 19.05,86.68 20.8,84.45 21.59,94.3 16.99,68.74 19.84,72.87 10.48,54.13 19.68,66.67 21.75,52.23 21.91,45.72 12.86,64.45 17.78,63.5
  pour Top: 0,0 38.1,0 38.1,100.33 0,100.33
  pour Bottom: 0,0 38.1,0 38.1,100.33 0,100.33
RSTIN  (via drill 0.46)
  Top 0.203: R24.1 28.75,12.7 28.75,11.79 v28.45,11.48 28.04,11.07 28.04,10.16 27.94,10.06 T2.C | v22.86,88.9 23.27,88.49 23.27,87.99 U$2.32 | v23.67,27.64 19.1,32.21 19.1,32.82 S1.3
  Bottom 0.203: v22.86,88.9 22.45,88.9 19.2,85.65 15.75,85.65 15.24,85.14 15.24,67.56 24.28,58.52 24.99,58.52 25.5,58.01 25.5,38.51 21.84,34.85 21.74,34.85 19.71,32.82 S1.3 | v28.45,11.48 28.45,15.85 23.67,20.62 v23.67,27.64
RX  (via drill 0.46)
  Top 0.203: v24.69,85.85 24.28,86.26 23.37,86.26 U$2.30
  Bottom 0.203: v24.69,85.85 24.69,78.23 23.67,77.22 23.67,70.81 28.04,66.45 28.75,66.45 30.48,64.72 JP1.4
TX  (via drill 0.46)
  Top 0.203: v28.04,82.5 28.04,83.62 24.59,87.07 23.37,87.07 U$2.31
  Bottom 0.203: v28.04,82.5 28.04,77.42 34.65,70.81 34.65,66.75 33.02,65.13 JP1.5

### Text on the board
tNames: Rebel Tech Logoi
bDocu: F2 | D4 | D5 | D6 | F1